# EAGLE schematic mixed (EAGLE 9.2.0)
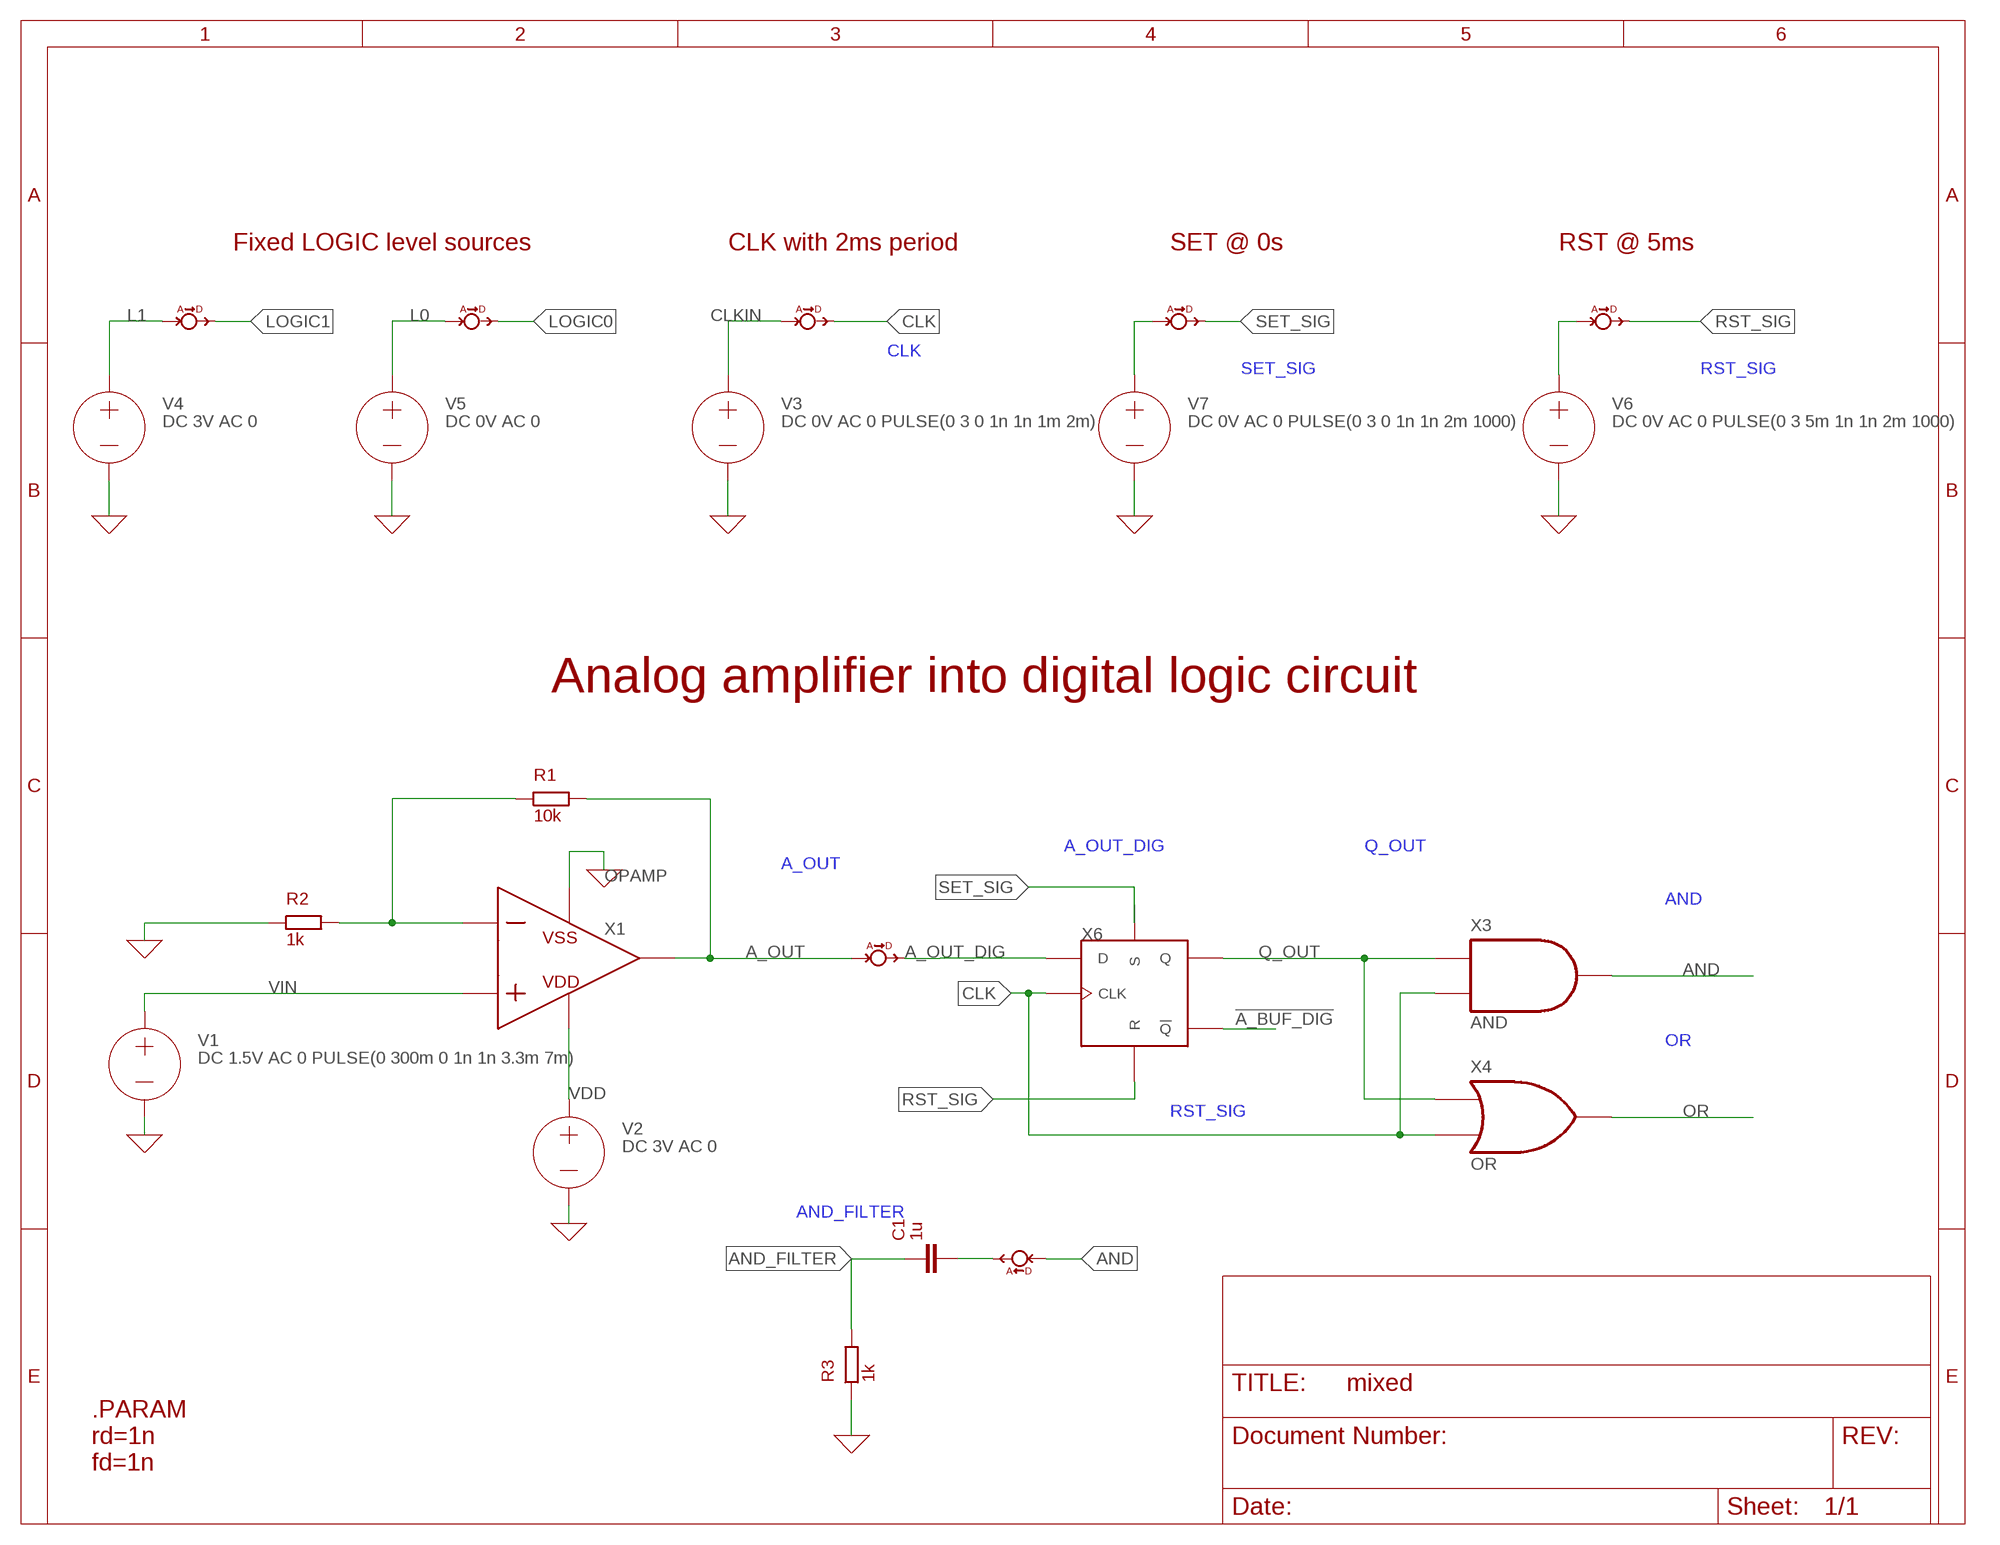
[diagram p0: schematic, sheet 1]

## Parts
C1  1u  C  (no package)
R1  10k  R  (no package)
R2  1k  R  (no package)
R3  1k  R  (no package)
V1  DC 1.5V AC 0 PULSE(0 300m 0 1n 1n 3.3m 7m)  VOLTAGE  (no package)
V2  DC 3V AC 0  VOLTAGE  (no package)
V3  DC 0V AC 0 PULSE(0 3 0 1n 1n 1m 2m)  VOLTAGE  (no package)
V4  DC 3V AC 0  VOLTAGE  (no package)
V5  DC 0V AC 0  VOLTAGE  (no package)
V6  DC 0V AC 0 PULSE(0 3 5m 1n 1n 2m 1000)  VOLTAGE  (no package)
V7  DC 0V AC 0 PULSE(0 3 0 1n 1n 2m 1000)  VOLTAGE  (no package)
X1  OPAMP  (no package)
X2  ATODB  (no package)
X3  AND  (no package)
X4  OR  (no package)
X5  ATODB  (no package)
X6  DFF  (no package)
X7  ATODB  (no package)
X8  DTOAB  (no package)
X14  ATODB  (no package)
X15  ATODB  (no package)
X16  ATODB  (no package)

## Nets
0: R2.1 R3.1 V1.- V2.- V3.- V4.- V5.- V6.- V7.- X1.VSS ; supply symbol labelled GND
!A_BUF_DIG: X6.!Q
A_OUT: R1.2 X1.VOUT X2.AN
A_OUT_DIG: X2.DIG X6.D
AND: X3.Y X8.DIG
AND_FILTER: C1.1 R3.2
CLK: X3.B X4.B X6.CLK X16.DIG
CLKIN: V3.+ X16.AN
L0: V5.+ X15.AN
L1: V4.+ X14.AN
LOGIC0: X15.DIG
LOGIC1: X14.DIG
N$1: R1.1 R2.2 X1.N
N$2: V6.+ X5.AN
N$3: V7.+ X7.AN
N$5: C1.2 X8.AN
OR: X4.Y
Q_OUT: X3.A X4.A X6.Q
RST_SIG: X5.DIG X6.R
SET_SIG: X6.S X7.DIG
VDD: V2.+ X1.VDD
VIN: V1.+ X1.P

## Notes on the sheet
- Fixed LOGIC level sources | CLK with 2ms period | SET @ 0s | RST @ 5ms
- Analog amplifier into digital logic circuit
- .PARAM
  rd=1n
  fd=1n

## Library data of the parts
C1 = ngspice-simulation:C: CAPACITOR
R1-R3 = ngspice-simulation:R: RESISTOR
V1-V7 = ngspice-simulation:VOLTAGE: Independent Voltage Source, either DC, AC, PULSE, SINE, PWL, EXP, or SFFM; VALUE: 0V
X1 = ngspice-simulation:OPAMP: Operational amplifier with power pins
X2 X5 X7 X14-X16 = ngspice-digital:ATODB: Analog to digital bridge
X3 = ngspice-digital:AND: 2 input logic AND gate
X4 = ngspice-digital:OR: 2 input logic OR gate
X6 = ngspice-digital:DFF: D TYPE FLIP FLOP
X8 = ngspice-digital:DTOAB: Digital to Analog Bridge